# Altium schematic sheet final.SchDoc
size 431 x 279 mm; SheetNumber: 1; SheetTotal: 1
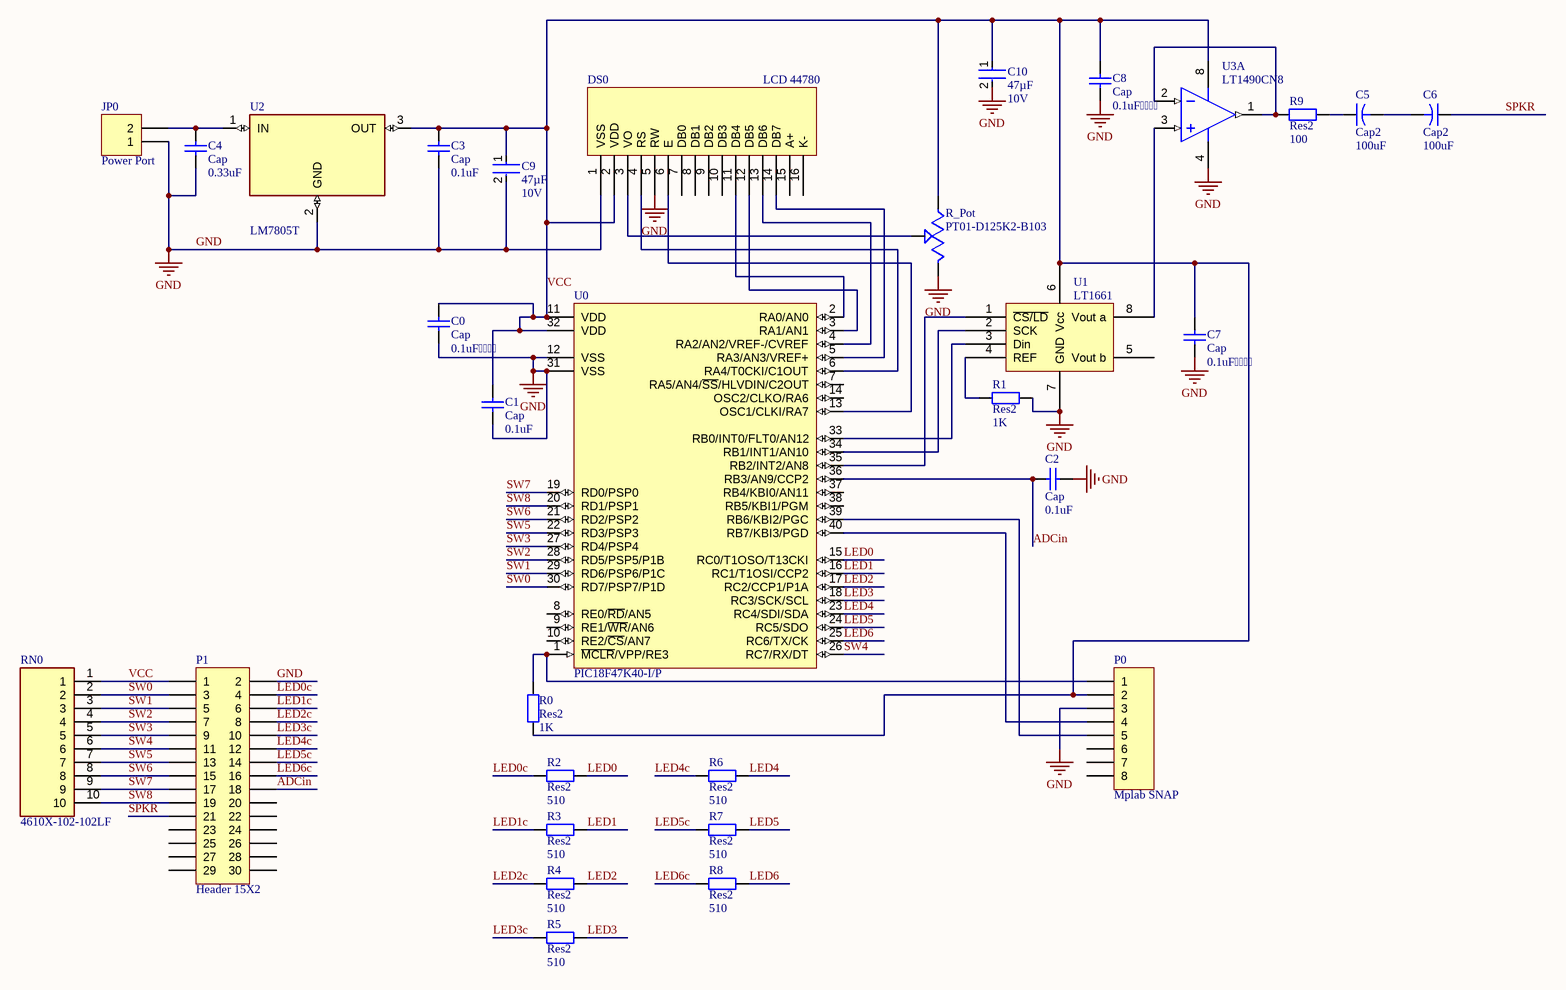
[diagram p0: final.SchDoc]

## Parts
C0  Cap  value 0.1uF  [RAD-0.3]
C1  Cap  value 0.1uF  [RAD-0.3]
C2  Cap  value 0.1uF  [RAD-0.3]
C3  Cap  value 0.1uF  [RAD-0.3]
C4  Cap  value 0.33uF  [RAD-0.3]
C5  Cap2  value 100uF  [CAPR5-4X5]
C6  Cap2  value 100uF  [CAPR5-4X5]
C7  Cap  value 0.1uF  [RAD-0.3]
C8  Cap  value 0.1uF  [RAD-0.3]
C9  Capacitance: 47µF  Voltage: 10V  [Kemet_C1206C476M8PACTU_0]  (hidden comment: Cap_Kemet_C1206C476M8PACTU_eec)
C10  Capacitance: 47µF  Voltage: 10V  [Kemet_C1206C476M8PACTU_0]  (hidden comment: Cap_Kemet_C1206C476M8PACTU_eec)
DS0  LCD 44780  [OLED 16x2]
JP0  Power Port  [CON2screw]
P0  Mplab SNAP  [HDR1X8]
P1  Header 15X2  [HDR2X15]
R0  Res2  value 1K  [AXIAL-0.4]
R1  Res2  value 1K  [AXIAL-0.4]
R2  Res2  value 510  [AXIAL-0.4]
R3  Res2  value 510  [AXIAL-0.4]
R4  Res2  value 510  [AXIAL-0.4]
R5  Res2  value 510  [AXIAL-0.4]
R6  Res2  value 510  [AXIAL-0.4]
R7  Res2  value 510  [AXIAL-0.4]
R8  Res2  value 510  [AXIAL-0.4]
R9  Res2  value 100  [AXIAL-0.4]
R_Pot  PT01-D125K2-B103  [TRIM_PT01-D125K2-B103]
RN0  4610X-102-102LF  [SIP249W51P254L2535H508Q10P]
U0  PIC18F47K40-I/P  [DIP-40]
U1  LT1661  [LT-N8]
U2  LM7805T  [TO220]
U3  LT1490CN8  [LT-N8-8]  (part A of 2)

## Nets
GND: C0.2 C1.1 C2.1 C3.1 C4.1 C7.2 C8.2 C9.2 C10.2 DS0.1(VSS) DS0.5(RW) JP0.1 P0.3 P1.2 R1.2 R_Pot.3 U0.12(VSS) U0.31(VSS) U1.7(GND) U2.2(GND) U3.4(V-)
ADCin: C2.2 P1.18 U0.36(RB3/AN9/CCP2)
LED0: R2.2 U0.15(RC0/T1OSO/T13CKI)
LED0c: P1.4 R2.1
LED1: R3.2 U0.16(RC1/T1OSI/CCP2)
LED1c: P1.6 R3.1
LED2: R4.2 U0.17(RC2/CCP1/P1A)
LED2c: P1.8 R4.1
LED3: R5.2 U0.18(RC3/SCK/SCL)
LED3c: P1.10 R5.1
LED4: R6.2 U0.23(RC4/SDI/SDA)
LED4c: P1.12 R6.1
LED5: R7.2 U0.24(RC5/SDO)
LED5c: P1.14 R7.1
LED6: R8.2 U0.25(RC6/TX/CK)
LED6c: P1.16 R8.1
SPKR: C6.1 P1.21
SW0: P1.3 RN0.2 U0.30(RD7/PSP7/P1D)
SW1: P1.5 RN0.3 U0.29(RD6/PSP6/P1C)
SW2: P1.7 RN0.4 U0.28(RD5/PSP5/P1B)
SW3: P1.9 RN0.5 U0.27(RD4/PSP4)
SW4: P1.11 RN0.6 U0.26(RC7/RX/DT)
SW5: P1.13 RN0.7 U0.22(RD3/PSP3)
SW6: P1.15 RN0.8 U0.21(RD2/PSP2)
SW7: P1.17 RN0.9 U0.19(RD0/PSP0)
SW8: P1.19 RN0.10 U0.20(RD1/PSP1)
VCC: C0.1 C1.2 C3.2 C7.1 C8.1 C9.1 C10.1 DS0.2(VDD) P0.2 P1.1 R0.1 R_Pot.1 RN0.1 U0.11(VDD) U0.32(VDD) U1.6(Vcc) U2.3(OUT) U3.8(V+)
NetC4_2: C4.2 JP0.2 U2.1(IN)
NetC5_1: C5.1 R9.2
NetC5_2: C5.2 C6.2
NetDS0_3: DS0.3(VO) R_Pot.2
NetDS0_4: DS0.4(RS) U0.6(RA4/T0CKI/C1OUT)
NetDS0_6: DS0.6(E) U0.13(OSC1/CLKI/RA7)
NetDS0_11: DS0.11(DB4) U0.2(RA0/AN0)
NetDS0_12: DS0.12(DB5) U0.3(RA1/AN1)
NetDS0_13: DS0.13(DB6) U0.4(RA2/AN2/VREF-/CVREF)
NetDS0_14: DS0.14(DB7) U0.5(RA3/AN3/VREF+)
NetP0_1: P0.1 R0.2 U0.1(~{MCLR}/VPP/RE3)
NetP0_4: P0.4 U0.40(RB7/KBI3/PGD)
NetP0_5: P0.5 U0.39(RB6/KBI2/PGC)
NetR1_1: R1.1 U1.4(REF)
NetR9_1: R9.1 U3.1(OUT_A) U3.2(-IN_A)
NetU0_33: U0.33(RB0/INT0/FLT0/AN12) U1.3(Din)
NetU0_34: U0.34(RB1/INT1/AN10) U1.2(SCK)
NetU0_35: U0.35(RB2/INT2/AN8) U1.1(~{CS/LD})
NetU1_8: U1.8(Vout_a) U3.3(+IN_A)

Not connected (* = marked no-connect by the designer): DS0 7(DB0) 8(DB1) 9(DB2) 10(DB3) 15(A+) 16(K-); P0 6 7 8; P1 20 22 23 24 25 26 27 28 29 30; U0 7(RA5/AN4/~{SS}/HLVDIN/C2OUT) 8(RE0/~{RD}/AN5) 9(RE1/~{WR}/AN6) 10(RE2/~{CS}/AN7) 14(OSC2/CLKO/RA6) 37(RB4/KBI0/AN11) 38(RB5/KBI1/PGM); U1 5(Vout_b)

## Notes on the sheet
- DWG. NO.
- REV.
- SHT.
- THIS DOCUMENT AND THE DATA DISCLOSED HEREIN OR HEREWITH IS THE PROPERTY OF ALTIUM LIMITED AND MAY BE FREELY DISTRIBUTED IN WHOLE. NO RIGHTS ARE RESERVED OR EXPRESS OR IMPLIED WARANTEE GIVEN.
- REVISION
- DESCRIPTION
- DATE
- APPROVED
- ENG:
- APPROVALS
- PROJECT
- DSN:
- CHK:
- REFERENCE DOCUMENTS
- PROJECT REVISION:
- TITLE
- DOCUMENT REVISION:
- DESIGN ITEM:
- BOM:
- FAB DWG:
- PCB DWG:
- ASSY DWG:
- SCALE:
- SIZE
- B
- CAGE CODE
- FILE NAME
- DWG NO.
- SHEET
- OF
- REV

## Library data of the parts
C0-C4 C7 C8 = Cap: Capacitor; Published: 8-Jun-2000; LatestRevisionDate: 17-Jul-2002; LatestRevisionNote: Re-released for DXP Platform.; PackageReference: RAD-0.3; Publisher: Altium Limited; PackageDescription: Radial Cap, Thru-Hole; 2 Leads; 0.3 in Pin Spacing
C5 C6 = Cap2: Capacitor; Published: 23-Sep-2002; PackageReference: CAPR5-4X5; Publisher: Altium Limited; PackageDescription: Capacitor; 2 Leads
C9 C10 = Cap_Kemet_C1206C476M8PACTU_eec: CAP 47µF ±20% 10V Ceramic Capacitor X5R 1206 (3216 Metric); Manufacturer: Kemet; Part Number: C1206C476M8PACTU; helpURL: https://upverter.com/upn/revision/2d48458e614f84a3/; ComponentLink2Description: Datasheet; Temperature: -55°C to +85°C; Package: 1206 (3216 metric); Supplier 2: Mouser; Price: 0.398824992937; Supplier 1: Digi-Key; ComponentLink1URL: https://upverter.com/upn/revision/2d48458e614f84a3/; Supplier Part Number 2: 80-C1206C476M8P; Supplier Part Number 1: 399-5508-1-ND; Value: 47µF; ComponentLink1Description: Upverter; ComponentLink2URL: https://upverter.com/datasheet/f4907562a9ebe4d70bacce08fab44b779a890536.pdf; RoHS: TRUE; Mouser Part Number: 80-C1206C476M8P; Ipc Land Pattern Name: CAPC320160X160; Tolerance: ±20%; Temperature Range High: +85°C; Digikey Description: CAP 47µF ±20% 10V Ceramic Capacitor X5R 1206 (3216 Metric); Digikey Part Number: 399-5508-1-ND; Lead Free: yes; Temperature Range Low: -55°C; Mounting Type: Surface Mount
JP0 = Power
P0 = Header 8: Header, 8-Pin; LatestRevisionDate: 17-Jul-2002; LatestRevisionNote: Re-released for DXP Platform.; Publisher: Altium Limited
P1 = Header 15X2: Header, 15-Pin, Dual row; LatestRevisionDate: 17-Jul-2002; LatestRevisionNote: Re-released for DXP Platform.; Publisher: Altium Limited
R0-R9 = Res2: Resistor; Published: 8-Jun-2000; LatestRevisionDate: 17-Jul-2002; LatestRevisionNote: Re-released for DXP Platform.; PackageReference: AXIAL-0.4; Publisher: Altium Limited; PackageDescription: Axial Device, Thru-Hole; 2 Leads; 0.4 in Pin Spacing
R_Pot = PT01-D125K2-B103: 10k Ohm 1 Gang Linear Through Hole Potentiometer None 1.0 Kierros Carbon 0.05W, 1/20W PC Pins; MF: CUI Devices; Check_prices: https://www.snapeda.com/parts/PT01-D125K2-B103/CUI+Devices/view-part/?ref=eda; Availability: In Stock; Price: None; Package: None; Value: *; SnapEDA_Link: https://www.snapeda.com/parts/PT01-D125K2-B103/CUI+Devices/view-part/?ref=snap; Purchase-URL: https://pricing.snapeda.com/search/part/PT01-D125K2-B103/?ref=eda; MP: PT01-D125K2-B103
RN0 = 4610X-102-102LF: Resistor Network; Manufacturer_Name: Bourns; Datasheet Link: https://componentsearchengine.com/Datasheets/2/4610X-102-102LF.pdf; Height: 5.08mm; Manufacturer_Part_Number: 4610X-102-102LF; Mouser Part Number: 652-4610X-2LF-1K; Mouser Price/Stock: https://www.mouser.co.uk/ProductDetail/Bourns/4610X-102-102LF?qs=Rl1knRB2A4tCodRie8H8UQ%3D%3D; Arrow Part Number: 4610X-102-102LF; Arrow Price/Stock: https://www.arrow.com/en/products/4610x-102-102lf/bourns
U0 = PIC18F4620-I/P_1: Enhanced Flash Microcontroller with 10-Bit A/D and nanoWatt Technology, 64K Flash, 40-Pin PDIP, Industrial Temperature Range; DatasheetVersion: revE, May-2008; PackageVersion: revBB, Aug-2009; PackageReference: PDIP600-P40; PackageDescription: 40-Lead Plastic Dual In-Line (P) - 600 mil Body [PDIP]; ComponentLink1Description: Manufacturer URL; ComponentLink1URL: http://www.microchip.com/; ComponentLink2Description: Datasheet; ComponentLink2URL: http://ww1.microchip.com/downloads/en/DeviceDoc/39626e.pdf; ComponentLink3Description: Package Specification; ComponentLink3URL: http://www.microchip.com/stellent/groups/techpub_sg/documents/packagingspec/en012702.pdf
U2 = LM7805T: MF: Texas Instruments; Availability: Not in stock; Price: None; SnapEDA_Link: https://www.snapeda.com/parts/LM7805T/Texas+Instruments/view-part/?ref=snap; Package: None; Check_prices: https://www.snapeda.com/parts/LM7805T/Texas+Instruments/view-part/?ref=eda; Value: *; MP: LM7805T
U3 = LT1490CN8: Dual Channel, Operational Amplifier, RRIO, Over-The-Top, 0.18 MHz Typical GBW, 0.06 V/us Typical SR, 2 to 44 V, 8-Pin DIP (N8-8), Commercial; Linear Technology Part Number: LT1490A; Manufacturer: Linear Technology; Channels (#): 2; GBW (MHz) Typical: 0.18; Is (mA) Typical: 0.04; SR (V/us) Typical: 0.06; Vos (mV) Typical: 0.11; Vs Max (V): 44; DatasheetVersion: Rev. D; PackageVersion: Rev I; PackageReference: LT-N8-8; PackageDescription: 8-Lead PDIP, Body 10.16 x 6.48 mm, Pitch 2.54 mm; Type: VFB; Vs Min (V): 2; Mounting Technology: Surface Mount; PartNumber: LT1490CN8; ComponentLink1Description: Datasheet; ComponentLink1URL: http://cds.linear.com/docs/Datasheet/14901afd.pdf; ComponentLink2Description: Package Specification; ComponentLink2URL: http://cds.linear.com/docs/Packaging/05081510_I_N8.pdf